# Altium schematic sheet L298.SchDoc
size 215 x 78 mm; SheetNumber: 5; SheetTotal: 6
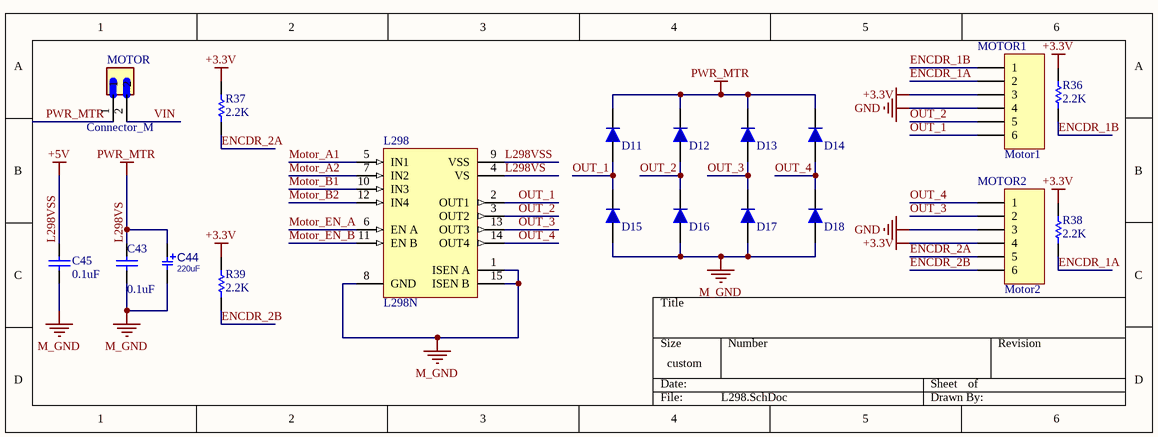
[diagram p0: L298.SchDoc]

## Parts
C43  0.1uF  [CAPC3413X12N]
C44  220uF  [C_EL_6_6]
C45  0.1uF  [CAPC3413X12N]
D11  1n4007  [DIOM4629X24N]  (value not drawn)
D12  1n4007  [DIOM4629X24N]  (value not drawn)
D13  1n4007  [DIOM4629X24N]  (value not drawn)
D14  1n4007  [DIOM4629X24N]  (value not drawn)
D15  1n4007  [DIOM4629X24N]  (value not drawn)
D16  1n4007  [DIOM4629X24N]  (value not drawn)
D17  1n4007  [DIOM4629X24N]  (value not drawn)
D18  1n4007  [DIOM4629X24N]  (value not drawn)
L298  L298N  [Multiwatt15H]
MOTOR  Connector_M  [JST_B2P-VH(LF)(SN)]
MOTOR1  Motor1  [MO-Header 6]
MOTOR2  Motor2  [MO-Header 6]
R36  2.2K  [RESC3413X04N]
R37  2.2K  [RESC3413X04N]
R38  2.2K  [RESC3413X04N]
R39  2.2K  [RESC3413X04N]

## Nets
+3.3V: MOTOR1.3 MOTOR2.4 R36.1 R37.1 R38.1 R39.1
GND: MOTOR1.4 MOTOR2.3
L298VS: C43.2 C44.1 D11.2 D12.2 D13.2 D14.2 L298.4(VS) MOTOR.1  [also labelled PWR_MTR]
L298VSS: C45.2 L298.9(VSS)  [also labelled +5V]
M_GND: C43.1 C44.2 C45.1 D15.1 D16.1 D17.1 D18.1 L298.1(ISEN_A) L298.8(GND) L298.15(ISEN_B)
ENCDR_1A: MOTOR1.2 R38.2
ENCDR_1B: MOTOR1.1 R36.2
ENCDR_2A: MOTOR2.5 R37.2
ENCDR_2B: MOTOR2.6 R39.2
Motor_A1: L298.5(IN1)
Motor_A2: L298.7(IN2)
Motor_B1: L298.10(IN3)
Motor_B2: L298.12(IN4)
Motor_EN_A: L298.6(EN_A)
Motor_EN_B: L298.11(EN_B)
OUT_1: D11.1 D15.2 L298.2(OUT1) MOTOR1.6
OUT_2: D12.1 D16.2 L298.3(OUT2) MOTOR1.5
OUT_3: D13.1 D17.2 L298.13(OUT3) MOTOR2.2
OUT_4: D14.1 D18.2 L298.14(OUT4) MOTOR2.1
VIN: MOTOR.2

## Library data of the parts
C43 C45 = CAP SMD 0805: CAP 0805; Designer: Abbas Basereh; Desc.: CAP SMD 0805; Data: 16-12-2016
C44 = CAP_SMD_EL: CAP, THD, ELEC,; MANF_P#: MANF_PART#; PARAM2: 20%; DESC: DESCRIPTION; DIST#: MOUSER; PARAM: 25V; PRICE: 10= 5$; MANF: MANF; ASSEMBLY: ASSEMBLY; VALUE: 220uF
D11-D18 = 1n4007 SMD M7: Standard Rectifiers; Part. No: M7; Manufacturer: DC COMPONENTS; Designer: Abbas Basereh; Link: http://www.tme.eu/en/details/m7/smd-universal-diodes/dc-components/; Link: https://www.aliexpress.com/item/Smd-tube-1n4007-m7-SMA/1213719741.html?spm=2114.01010208.3.1.ZyZ7bC&ws_ab_test=searchweb0_0,searchweb201602_4_10065_10068_10084_10083_10080_10082_10081_10060_10061_10062_10056_10055_10054_10059_10099_10078_10079_427_10073_10103_10102_10096_10052_10050_10051,searchweb201603_4&btsid=db2be5ca-e560-400a-b91c-484ab5ee228b; Data: 16-12-2016
L298 = L298N: Dual Full Bridge Driver; Revision 1: 24-Aug-2001: Footprint Added.; Revision 2: 17-Jul-2002: Re-released for DXP Platform.; Package Information: Latest Revision: Apr-1998; Published: 8-Jun-2000; Datasheet: Latest Revision: Jul-1999; Package Reference: Multiwatt15H; Publisher: Altium Limited
MOTOR = B2P-VH(LF)(SN): Connector Header Through Hole 2 position 0.156 (3.96mm); MF: JST Sales; Price: None; Availability: In Stock; Package: None; MP: B2P-VH(LF)(SN); Value: *; SnapEDA_Link: https://www.snapeda.com/parts/B2P-VH(LF)(SN)/JST+Sales+America+Inc./view-part/?ref=snap; Purchase-URL: https://pricing.snapeda.com/search/part/B2P-VH(LF)(SN)/?ref=eda; Check_prices: https://www.snapeda.com/parts/B2P-VH(LF)(SN)/JST+Sales+America+Inc./view-part/?ref=eda
MOTOR1 MOTOR2 = Header 6: Header, 6-Pin; LatestRevisionDate: 17-Jul-2002; LatestRevisionNote: Re-released for DXP Platform.; Publisher: Altium Limited
R36-R39 = RES 0805 0.125W: RES 0805; Designer: Abbas Basereh; Desc.: RES SMD 0805; Data: 16-12-2016